# Altium project Medical_Smart_Watch.PrjPcb
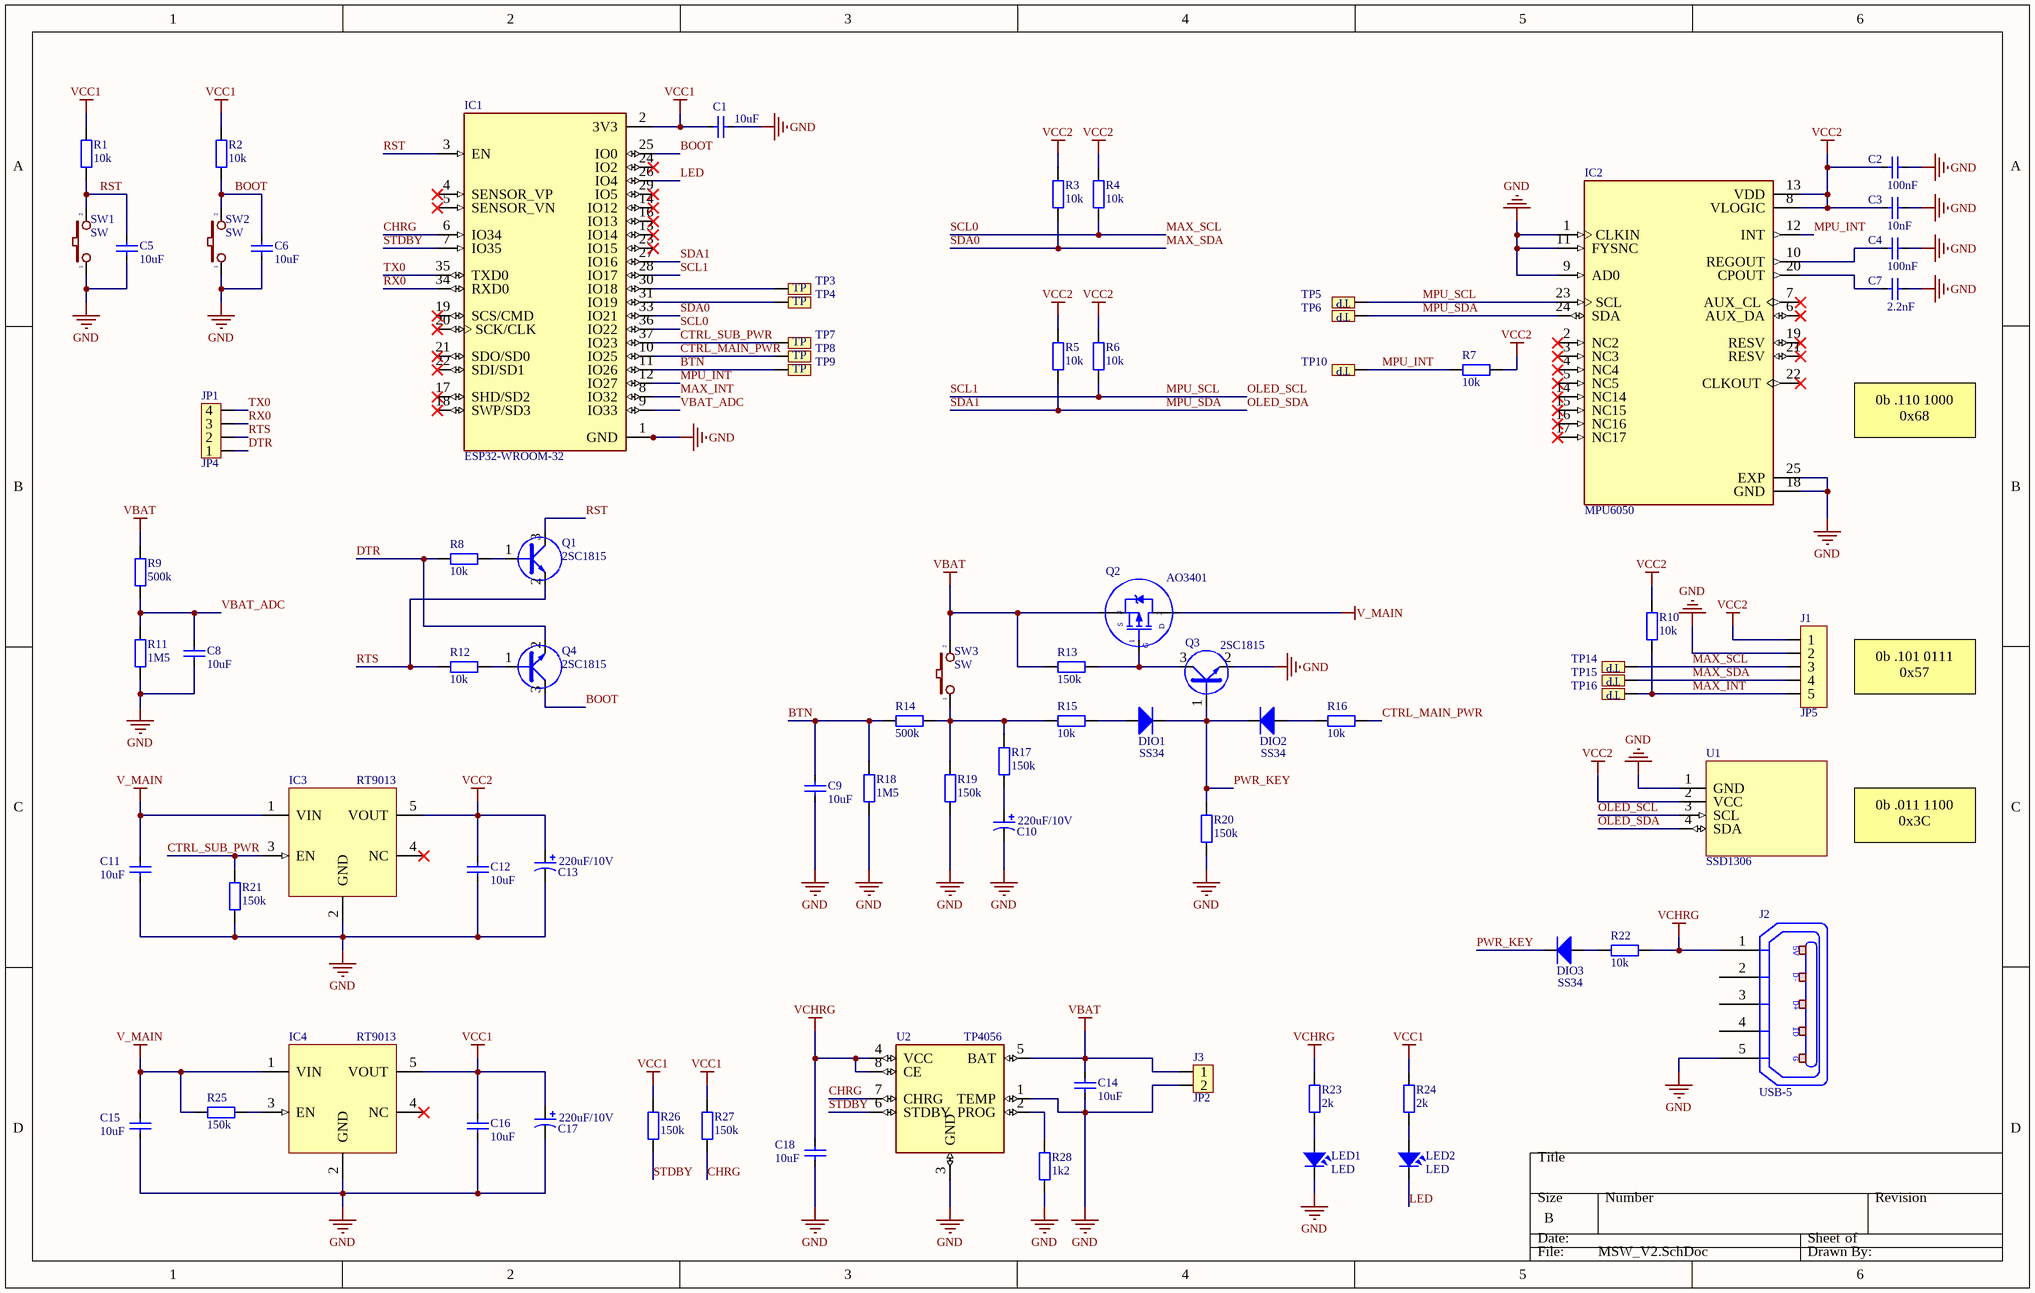
[diagram p0: MSW_V2.SchDoc]
1 sheet, 79 parts. Net scope: global (net labels, ports and power ports of the same name join across sheets).
Board file: MSW_V2.PcbDoc

## Sheet MSW_V2.SchDoc
size B; Organization: ORGANIZATION; Address1: ADDRESS 1; Address2: ADDRESS 2; Address3: ADDRESS 3; Address4: ADDRESS 4; Revision: -; SheetNumber: 1; SheetTotal: 1; ENG_APP_DATE: --/--/--; DSN_APP_DATE: --/--/--; CHK_APP_DATE: --/--/--

### Parts
C1  10uF  [CAP_0603]
C2  100nF  [CAP_0603]
C3  10nF  [CAP_0603]
C4  100nF  [CAP_0603]
C5  10uF  [CAP_0603]
C6  10uF  [CAP_0603]
C7  2.2nF  [CAP_0603]
C8  10uF  [CAP_0603]
C9  10uF  [CAP_0603]
C10  220uF/10V  [CAP_7343]
C11  10uF  [CAP_0603]
C12  10uF  [CAP_0603]
C13  220uF/10V  [CAP_7343]
C14  10uF  [CAP_0603]
C15  10uF  [CAP_0603]
C16  10uF  [CAP_0603]
C17  220uF/10V  [CAP_7343]
C18  10uF  [CAP_0603]
DIO1  SS34  [DIO-214AC(SMA)]
DIO2  SS34  [DIO-214AC(SMA)]
DIO3  SS34  [DIO-214AC(SMA)]
IC1  ESP32-WROOM-32  [MODULE_ESP32-WROOM-32]
IC2  MPU6050  [QFN24]
IC3  RT9013  [SOT23-5]
IC4  RT9013  [SOT23-5]
J1  JP5  [Header5 - TH - 1.25MM]
J2  USB-5  [USB-M4]
J3  JP2  [JP2-C1T]
JP1  JP4  [Header4 - TH - 1.25MM]
LED1  LED  [LED-0805-Red]
LED2  LED  [LED-0805-Blue]
Q1  2SC1815  [SOT23D]
Q2  AO3401  [SOT23A]
Q3  2SC1815  [SOT23D]
Q4  2SC1815  [SOT23D]
R1  10k  [RES-SMD-0603]
R2  10k  [RES-SMD-0603]
R3  10k  [RES-SMD-0603]
R4  10k  [RES-SMD-0603]
R5  10k  [RES-SMD-0603]
R6  10k  [RES-SMD-0603]
R7  10k  [RES-SMD-0603]
R8  10k  [RES-SMD-0603]
R9  500k  [RES-SMD-0603]
R10  10k  [RES-SMD-0603]
R11  1M5  [RES-SMD-0603]
R12  10k  [RES-SMD-0603]
R13  150k  [RES-SMD-0603]
R14  500k  [RES-SMD-0603]
R15  10k  [RES-SMD-0603]
R16  10k  [RES-SMD-0603]
R17  150k  [RES-SMD-0603]
R18  1M5  [RES-SMD-0603]
R19  150k  [RES-SMD-0603]
R20  150k  [RES-SMD-0603]
R21  150k  [RES-SMD-0603]
R22  10k  [RES-SMD-0603]
R23  2k  [RES-SMD-0603]
R24  2k  [RES-SMD-0603]
R25  150k  [RES-SMD-0603]
R26  150k  [RES-SMD-0603]
R27  150k  [RES-SMD-0603]
R28  1k2  [RES-SMD-0603]
SW1  SW  [SW 3x2x4]
SW2  SW  [SW 3x2x4]
SW3  SW  [BUTTON 2P SMD SIDE 2x4x3.5]
TP3  TP  [TP_SMD]  (value not drawn)
TP4  TP  [TP_SMD]  (value not drawn)
TP5  TP  [TP_SMD]  (value not drawn)
TP6  TP  [TP_SMD]  (value not drawn)
TP7  TP  [TP_SMD]  (value not drawn)
TP8  TP  [TP_SMD]  (value not drawn)
TP9  TP  [TP_SMD]  (value not drawn)
TP10  TP  [TP_SMD]  (value not drawn)
TP14  TP  [TP_SMD]  (value not drawn)
TP15  TP  [TP_SMD]  (value not drawn)
TP16  TP  [TP_SMD]  (value not drawn)
U1  SSD1306  [OLED 1.3 SSD1306 NON POLE]
U2  TP4056  [TP4056]

### Nets
GND: C1.1 C2.1 C3.1 C4.1 C5.1 C6.1 C7.1 C8.1 C9.1 C10.2 C11.1 C12.1 C13.2 C14.1 C15.1 C16.1 C17.2 C18.1 IC1.1(GND) IC1.15(GND) IC1.38(GND) IC1.39_1(GND) IC1.39_2(GND) IC1.39_3(GND) IC1.39_4(GND) IC1.39_5(GND) IC1.39_6(GND) IC1.39_7(GND) IC1.39_8(GND) IC1.39_9(GND) IC1.39_10(GND) IC1.39_11(GND) IC1.39_12(GND) IC1.39_13(GND) IC1.39_14(GND) IC1.39_15(GND) IC1.39_16(GND) IC1.39_17(GND) IC1.39_18(GND) IC1.39_19(GND) IC1.39_20(GND) IC1.39_21(GND) IC2.1(CLKIN) IC2.9(AD0) IC2.11(FYSNC) IC2.18(GND) IC2.25(EXP) IC3.2(GND) IC4.2(GND) J1.2 J2.5(P5) J3.2 LED1.2 Q3.2(E) R11.1 R18.1 R19.2 R20.2 R21.2 R28.1 SW1.1 SW2.1 U1.1(GND) U2.1(TEMP) U2.3(GND)
V_MAIN: C11.2 C15.2 IC3.1(VIN) IC4.1(VIN) Q2.2(D) R25.1
VBAT: C14.2 J3.1 Q2.3(S) R9.2 R13.1 SW3.2 U2.5(BAT)
VCC1: C1.2 C16.2 C17.1 IC1.2(3V3) IC4.5(VOUT) R1.1 R2.1 R24.2 R26.1 R27.1
VCC2: C2.2 C3.2 C12.2 C13.1 IC2.8(VLOGIC) IC2.13(VDD) IC3.5(VOUT) J1.1 R3.2 R4.2 R5.2 R6.2 R7.1 R10.1 U1.2(VCC)
VCHRG: C18.2 J2.1(P1) R22.2 R23.2 U2.4(VCC) U2.8(CE)
BOOT: C6.2 IC1.25(IO0) Q4.3(C) R2.2 SW2.2
BTN: C9.2 IC1.11(IO26) R14.2 R18.2 TP9.1
CHRG: IC1.6(IO34) R27.2 U2.7(CHRG)
CTRL_MAIN_PWR: IC1.10(IO25) R16.2 TP8.1
CTRL_SUB_PWR: IC1.37(IO23) IC3.3(EN) R21.1 TP7.1
DTR: JP1.1 Q4.2(E) R8.2
LED: IC1.26(IO4) LED2.2
MAX_INT: IC1.8(IO32) J1.5 R10.2 TP16.1
MAX_SCL: IC1.36(IO22) J1.3 R4.1 TP14.1  [also labelled SCL0]
MAX_SDA: IC1.33(IO21) J1.4 R3.1 TP15.1  [also labelled SDA0]
MPU_INT: IC1.12(IO27) IC2.12(INT) R7.2 TP10.1
MPU_SCL: IC1.28(IO17) IC2.23(SCL) R6.1 TP5.1 U1.3(SCL)  [also labelled OLED_SCL, SCL1]
MPU_SDA: IC1.27(IO16) IC2.24(SDA) R5.1 TP6.1 U1.4(SDA)  [also labelled OLED_SDA, SDA1]
PWR_KEY: DIO1.2(K) DIO2.2(K) DIO3.2(K) Q3.1(B) R20.1
RST: C5.2 IC1.3(EN) Q1.3(C) R1.2 SW1.2
RTS: JP1.2 Q1.2(E) R12.2
RX0: IC1.34(RXD0) JP1.3
STDBY: IC1.7(IO35) R26.2 U2.6(STDBY)
TX0: IC1.35(TXD0) JP1.4
VBAT_ADC: C8.2 IC1.9(IO33) R9.1 R11.2
NetC4_2: C4.2 IC2.10(REGOUT)
NetC7_2: C7.2 IC2.20(CPOUT)
NetC10_1: C10.1 R17.2
NetDIO1_1: DIO1.1(A) R15.2
NetDIO2_1: DIO2.1(A) R16.1
NetDIO3_1: DIO3.1(A) R22.1
NetIC1_30: IC1.30(IO18) TP3.1
NetIC1_31: IC1.31(IO19) TP4.1
NetIC4_3: IC4.3(EN) R25.2
NetLED1_1: LED1.1 R23.1
NetLED2_1: LED2.1 R24.1
NetQ1_1: Q1.1(B) R8.1
NetQ2_1: Q2.1(G) Q3.3(C) R13.2
NetQ4_1: Q4.1(B) R12.1
NetR14_1: R14.1 R15.1 R17.1 R19.1 SW3.1
NetR28_2: R28.2 U2.2(PROG)

Not connected (* = marked no-connect by the designer): IC1 4(SENSOR_VP)* 5(SENSOR_VN)* 13(IO14)* 14(IO12)* 16(IO13)* 17(SHD/SD2)* 18(SWP/SD3)* 19(SCS/CMD)* 20(SCK/CLK)* 21(SDO/SD0)* 22(SDI/SD1)* 23(IO15)* 24(IO2)* 29(IO5)*; IC2 2(NC2)* 3(NC3)* 4(NC4)* 5(NC5)* 6(AUX_DA)* 7(AUX_CL)* 14(NC14)* 15(NC15)* 16(NC16)* 17(NC17)* 19(RESV)* 21(RESV)* 22(CLKOUT)*; IC3 4(NC)*; IC4 4(NC)*; J2 2(P2) 3(P3) 4(P4)

### Notes on the sheet
- 0b .110 1000
  0x68
- 0b .101 0111
  0x57
- 0b .011 1100
  0x3C
- DWG. NO.
- REV.
- SHT.
- THIS DOCUMENT AND THE DATA DISCLOSED HEREIN OR HEREWITH IS THE PROPERTY OF ALTIUM LIMITED AND MAY BE FREELY DISTRIBUTED IN WHOLE. NO RIGHTS ARE RESERVED OR EXPRESS OR IMPLIED WARANTEE GIVEN.
- REVISION
- DESCRIPTION
- DATE
- APPROVED
- ENG:
- APPROVALS
- PROJECT
- DSN:
- CHK:
- REFERENCE DOCUMENTS
- PROJECT REVISION:
- TITLE
- DOCUMENT REVISION:
- DESIGN ITEM:
- BOM:
- FAB DWG:
- PCB DWG:
- ASSY DWG:
- SCALE:
- SIZE
- B
- CAGE CODE
- FILE NAME
- DWG NO.
- SHEET
- OF
- REV
- (in symbol USB-5) 5V; D-; D+; ID; G

### Library data of the parts
C1-C9 C11 C12 C14-C16 C18 = CapSMD: Capacitor; Value: 33p; Published: 8-Jun-2000; LatestRevisionDate: 17-Jul-2002; LatestRevisionNote: Re-released for DXP Platform.; PackageReference: RAD-0.3; Publisher: Altium Limited
C10 C13 C17 = CAP_TAN_SMD: Polazied Tantalum Capacitor
DIO1-DIO3 = Diode SMD: Default Diode; Code - JEDEC: DO-214-AB; Value: 1N5007; Published: 8-Jun-2000; Revision: July-2002: Re-released for DXP Platform.; Publisher: Altium Limited
IC1 = ESP32-WROOM-32: Bluetooth, WiFi Transceiver Module 2.4GHz ~ 2.5GHz Surface Mount; MF: Espressif Systems; Package: Module Espressif Systems; Digi-Key_Part_Number: 1904-1010-1-ND; Digi-Key_Purchase_URL: https://www.digikey.com/product-detail/en/espressif-systems/ESP32-WROOM-32/1904-1010-1-ND/8544305?utm_source=snapeda&utm_medium=aggregator&utm_campaign=symbol; Value: *; MP: ESP32-WROOM-32; SnapEDA_Link: https://www.snapeda.com/parts/ESP32-WROOM-32/Espressif%20Systems/view-part/2753322/?ref=snap
IC2 = MPU6050_Chip: 3-axis gyroscope, 3-axis accelerometer
IC3 IC4 = RT9013: RT9013-33GB IC REG LINEAR 3.3V 500mA SOT23-5
J1 = JP5x1: WR-PHD 2.54 mm Angled Socket Header; Manufacturer: W¨¹rth Elektronik eiSos GmbH; partNo: 613005143121; ComponentLink1 Description: Manufacturer; ComponentLink2 Description: Datasheet; NoPins: 05; Created Date: 29 March 2013; ComponentLink1URL: http://www.we-online.com; ComponentLink2URL: http://katalog.we-online.de/em/datasheet/6130xx143121.pdf; Created by: Karrer Zheng
J2 = USB-5: Manufacturer: FCI; Manufacturer Part Number: 10118193-0001LF; Connector Type: USB - micro B; Number of Contacts: 5; Gender: Receptacle; Specifications: USB 2.0; .Creator: MM; .Checked PCB: RF; Supplier 1: Digi-Key; RoHS: RoHS Compliant; Category: Connectors, Interconnects; Stock 1: 28642; Pricing 1: 1=0.46, 10=0.433, 25=0.3712, 50=0.3156, 100=0.3032, 250=0.27224, 500=0.25988 (USD); Packaging: Cut Tape (CT); Mounting Type: Surface Mount, Right Angle, Horizontal; Features: Shielded, Solder Retention; Ingress Protection: -; ComponentLink1URL: http://portal.fciconnect.com/Comergent//fci/drawing/10118193.pdf; ComponentLink1Description: http://portal.fciconnect.com/Comergent//fci/drawing/10118193.pdf; Supplier Part Number 1: 609-4616-1-ND; .Checked SCH: MM
J3 = JP2: WR-PHD 2.54 mm Angled Socket Header; Manufacturer: W¨¹rth Elektronik eiSos GmbH; partNo: 613002143121; ComponentLink1 Description: Manufacturer; ComponentLink2 Description: Datasheet; NoPins: 02; Created Date: 29 March 2013; ComponentLink1URL: http://www.we-online.com; ComponentLink2URL: http://katalog.we-online.de/em/datasheet/6130xx143121.pdf; Created by: Karrer Zheng
JP1 = JP4: WR-PHD 2.54 mm Angled Socket Header; Manufacturer: W¨¹rth Elektronik eiSos GmbH; partNo: 613004143121; ComponentLink1 Description: Manufacturer; ComponentLink2 Description: Datasheet; NoPins: 04; Created Date: 29 March 2013; ComponentLink1URL: http://www.we-online.com; ComponentLink2URL: http://katalog.we-online.de/em/datasheet/6130xx143121.pdf; Created by: Karrer Zheng
LED1 LED2 = LED: LED Single colour Green and Red; Value: LED 3 ly Single Colour
Q1 Q3 Q4 = C1815: NPN 600mW, ECB; Value: C1815
Q2 = MOSFET_P: Generic P Channel MOSFET
R1-R28 = Resistor - SMD: Resistor SMD; Manufacturer: Generic Components; Class: Passive; Published: 08/06/2000; Publisher: Altium Hobart Technology Centre
SW1-SW3 = SW2: Switch button 2 pin; Value: SW chip 2 pin
TP3-TP10 TP14-TP16 = TP: CONNECT 1
U1 = OLED 1.3 SSD1306: OLED Display 1.3" SSD1306
U2 = TP4056: Complete single cell Li-Ion battery with a constant current / constant voltage linear charger